# EAGLE design PololuStepperDriverCarrierBoard (EAGLE 6.3)
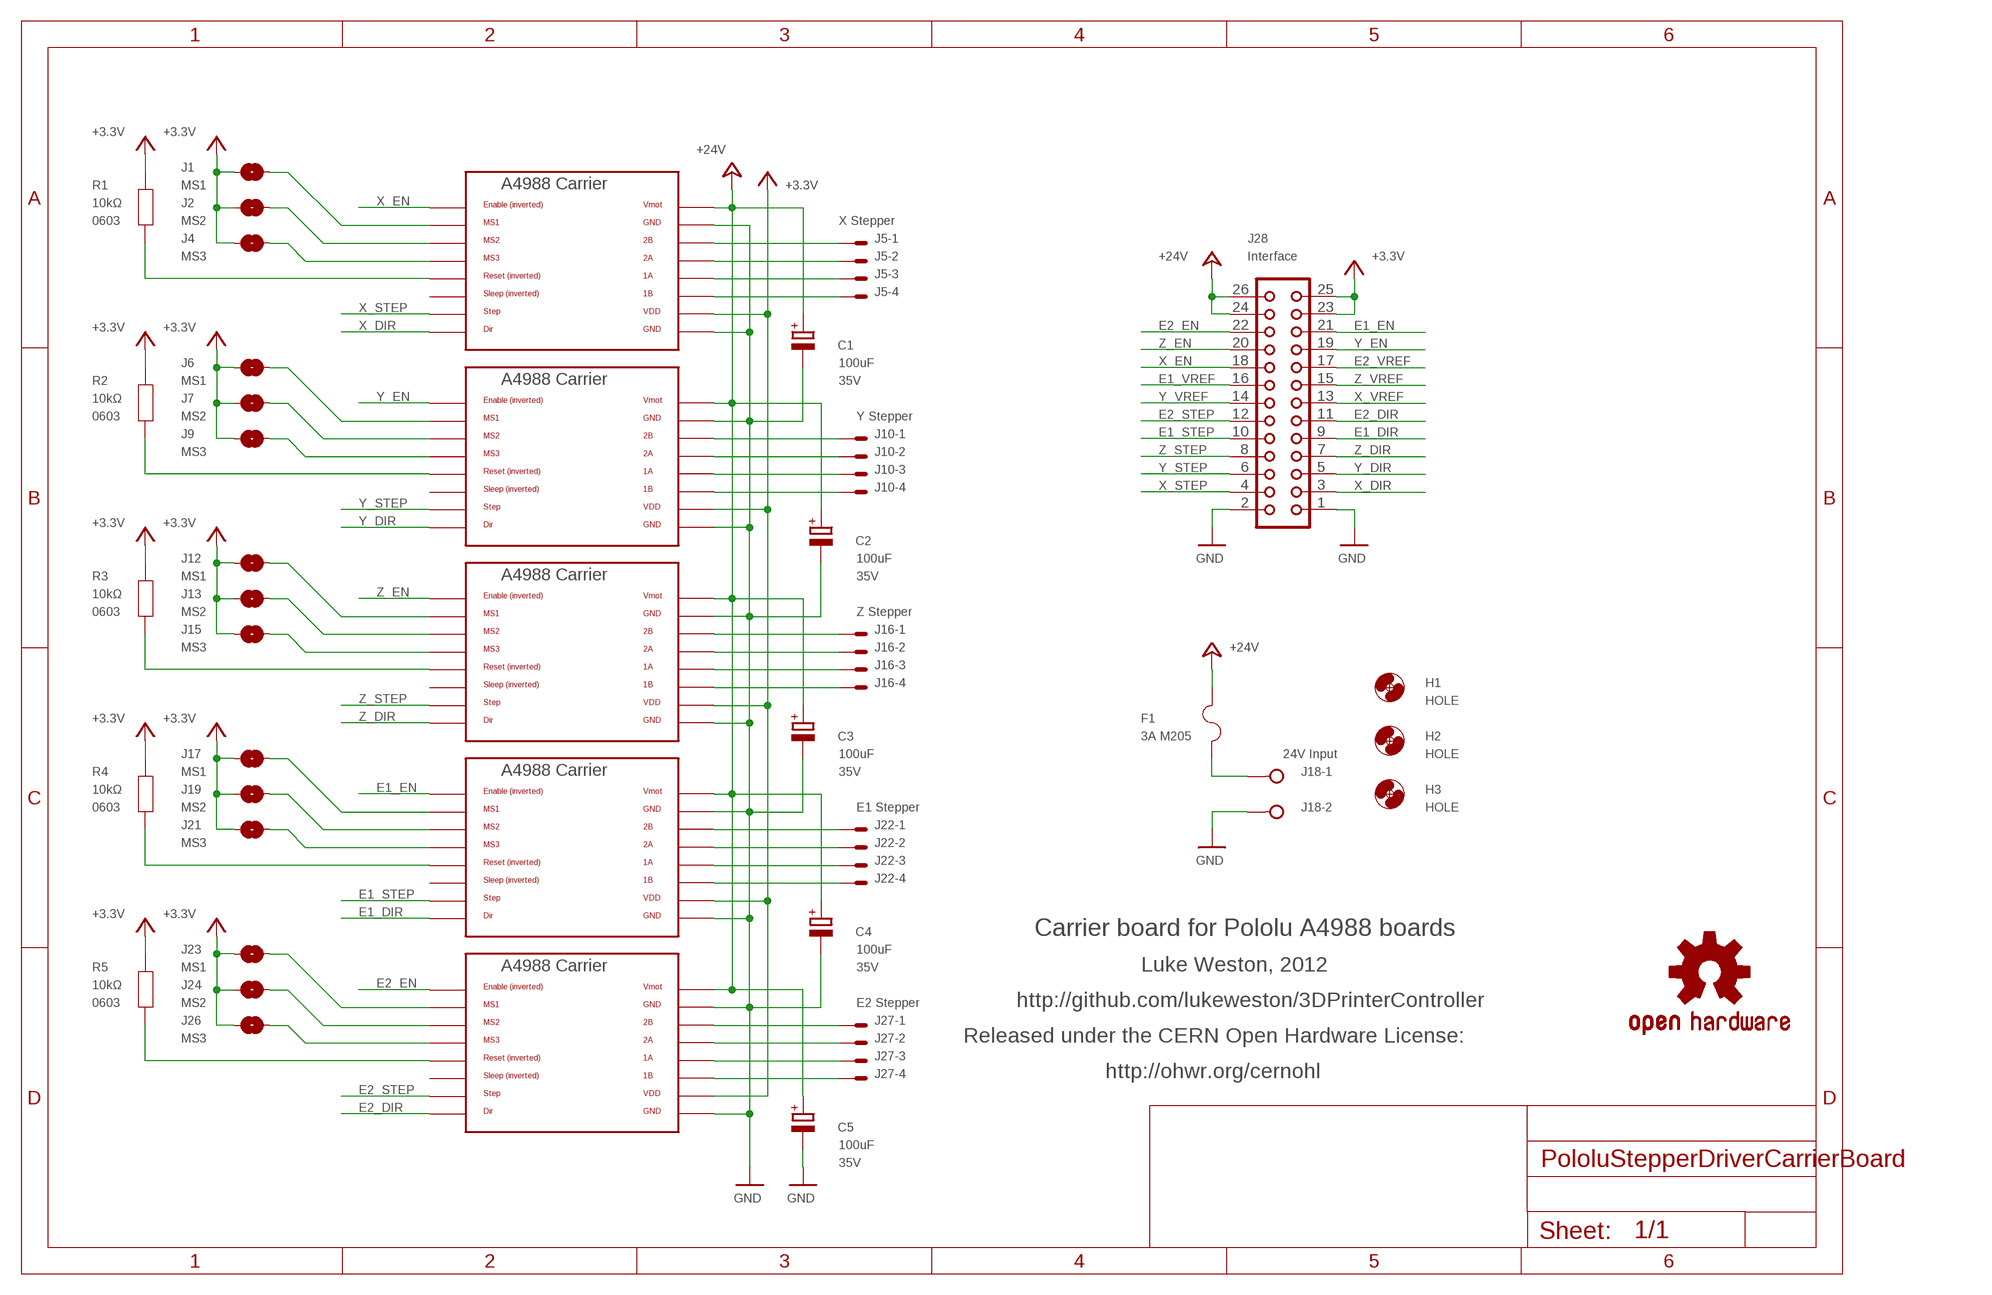
[diagram p0: schematic, sheet 1]

## Parts
C1  100uF  CPOL-EUE2.5-6  [E2,5-6]
C2  100uF  CPOL-EUE2.5-6  [E2,5-6]
C3  100uF  CPOL-EUE2.5-6  [E2,5-6]
C4  100uF  CPOL-EUE2.5-6  [E2,5-6]
C5  100uF  CPOL-EUE2.5-6  [E2,5-6]
F1  3A M205  FUSESHK20L  [SHK20L]
H1  HOLE  MOUNT-HOLE3.2  [3,2]
H2  HOLE  MOUNT-HOLE3.2  [3,2]
H3  HOLE  MOUNT-HOLE3.2  [3,2]
J1  MS1  SJ  [SJ]
J2  MS2  SJ  [SJ]
J3  A4988BREAKOUT  [A4988BREAKOUT]
J4  MS3  SJ  [SJ]
J5  X Stepper  22-05-7048-04  [7395-04]
J6  MS1  SJ  [SJ]
J7  MS2  SJ  [SJ]
J8  A4988BREAKOUT  [A4988BREAKOUT]
J9  MS3  SJ  [SJ]
J10  Y Stepper  22-05-7048-04  [7395-04]
J12  MS1  SJ  [SJ]
J13  MS2  SJ  [SJ]
J14  A4988BREAKOUT  [A4988BREAKOUT]
J15  MS3  SJ  [SJ]
J16  Z Stepper  22-05-7048-04  [7395-04]
J17  MS1  SJ  [SJ]
J18  24V Input  W237-02P  [W237-132]
J19  MS2  SJ  [SJ]
J20  A4988BREAKOUT  [A4988BREAKOUT]
J21  MS3  SJ  [SJ]
J22  E1 Stepper  22-05-7048-04  [7395-04]
J23  MS1  SJ  [SJ]
J24  MS2  SJ  [SJ]
J25  A4988BREAKOUT  [A4988BREAKOUT]
J26  MS3  SJ  [SJ]
J27  E2 Stepper  22-05-7048-04  [7395-04]
J28  Interface  CON26L  [CON26L]
R1  10kΩ  RESISTOR0603  [0603]
R2  10kΩ  RESISTOR0603  [0603]
R3  10kΩ  RESISTOR0603  [0603]
R4  10kΩ  RESISTOR0603  [0603]
R5  10kΩ  RESISTOR0603  [0603]
SY1  OSHW-LOGOS  [OSHW-LOGO-S]

## Nets
+3V3: J1.1 J2.1 J3.VDD J4.1 J6.1 J7.1 J8.VDD J9.1 J12.1 J13.1 J14.VDD J15.1 J17.1 J19.1 J20.VDD J21.1 J23.1 J24.1 J25.VDD J26.1 J28.23 J28.25 R1.1 R2.1 R3.1 R4.1 R5.1 ; supply symbol labelled +3.3V
+24V: C1.+ C2.+ C3.+ C4.+ C5.+ F1.2A J3.VMOT J8.VMOT J14.VMOT J20.VMOT J25.VMOT J28.24 J28.26
E1_DIR: J20.DIR J28.9
E1_EN: J20.EN J28.21
E1_STEP: J20.STEP J28.10
E1_VREF: J28.16
E2_DIR: J25.DIR J28.11
E2_EN: J25.EN J28.22
E2_STEP: J25.STEP J28.12
E2_VREF: J28.17
GND: C1.- C2.- C3.- C4.- C5.- J3.GND J3.GND@0(GND) J8.GND J8.GND@0(GND) J14.GND J14.GND@0(GND) J18.2 J20.GND J20.GND@0(GND) J25.GND J25.GND@0(GND) J28.1 J28.2
N$30: J8.RST R2.2
N$31: J3.2B J5.1
N$34: J3.1B J5.4
N$35: J3.1A J5.3
N$36: J3.2A J5.2
N$37: J8.2B J10.1
N$38: J8.1A J10.3
N$39: J8.2A J10.2
N$40: J8.1B J10.4
N$41: J14.2B J16.1
N$43: J14.1B J16.4
N$45: J14.1A J16.3
N$46: J14.2A J16.2
N$47: J20.2A J22.2
N$48: J20.2B J22.1
N$49: J20.1A J22.3
N$50: J20.1B J22.4
N$52: J25.2B J27.1
N$53: J25.2A J27.2
N$54: J25.1A J27.3
N$55: J25.1B J27.4
N$56: J3.RST R1.2
N$57: J8.MS3 J9.2
N$58: J7.2 J8.MS2
N$60: J3.MS3 J4.2
N$64: J2.2 J3.MS2
N$65: J1.2 J3.MS1
N$66: J6.2 J8.MS1
N$67: J14.RST R3.2
N$68: J14.MS3 J15.2
N$69: J13.2 J14.MS2
N$70: J12.2 J14.MS1
N$71: J25.RST R5.2
N$72: J25.MS3 J26.2
N$73: J24.2 J25.MS2
N$74: J23.2 J25.MS1
N$75: J20.RST R4.2
N$76: J20.MS3 J21.2
N$77: J19.2 J20.MS2
N$78: J17.2 J20.MS1
N$79: F1.1A J18.1
X_DIR: J3.DIR J28.3
X_EN: J3.EN J28.18
X_STEP: J3.STEP J28.4
X_VREF: J28.13
Y_DIR: J8.DIR J28.5
Y_EN: J8.EN J28.19
Y_STEP: J8.STEP J28.6
Y_VREF: J28.14
Z_DIR: J14.DIR J28.7
Z_EN: J14.EN J28.20
Z_STEP: J14.STEP J28.8
Z_VREF: J28.15
Unconnected: J3.SLP(SLEEP) J8.SLP(SLEEP) J14.SLP(SLEEP) J20.SLP(SLEEP) J25.SLP(SLEEP)

## Notes on the sheet
- Carrier board for Pololu A4988 boards
- Luke Weston, 2012
- http://github.com/lukeweston/3DPrinterController
- Released under the CERN Open Hardware License:
- http://ohwr.org/cernohl

## Library data of the parts
C1-C5 = rcl:CPOL-EU: POLARIZED CAPACITOR, European symbol; VOLTAGE: 35V
F1 = fuse:FUSE: Fuse; OC_FARNELL: unknown; OC_NEWARK: unknown
H1-H3 = holes:MOUNT-HOLE: MOUNTING HOLE with drill center marker
J1 J2 J4 J6 J7 J9 J12 J13 J15 J17 J19 J21 J23 J24 J26 = freetronics-luke:SJ: PCB "solder jumper". Note that there should nothing on the BOM corresponding to this "component".
J3 J8 J14 J20 J25 = RepRapjr:A4988BREAKOUT
J5 J10 J16 J22 J27 = con-molex:22-?-04: CONNECTOR wire to board 2.54 mm (.1 inch) pitch header; OC_FARNELL: unknown; OC_NEWARK: unknown
J18 = con-wago-508:W237-02P: WAGO SREW CLAMP; OC_FARNELL: unknown; OC_NEWARK: unknown
J28 = con-harting:CON26L: CONNECTOR; OC_FARNELL: unknown; OC_NEWARK: unknown
R1-R5 = freetronics-master-v1:RESISTOR: Resistor Basic schematic elements and footprints for 0603, 1206, and PTH 1/10th watt (small) resistors.; PACKAGE: 0603
SY1 = SparkFun:OSHW-LOGO: Open Source Hardware Logo This logo indicates the piece of hardware it is found on incorporates a OSHW license and/or adheres to the definition of open source hardware found here: http://freedomdefined.org/OSHW

## Board
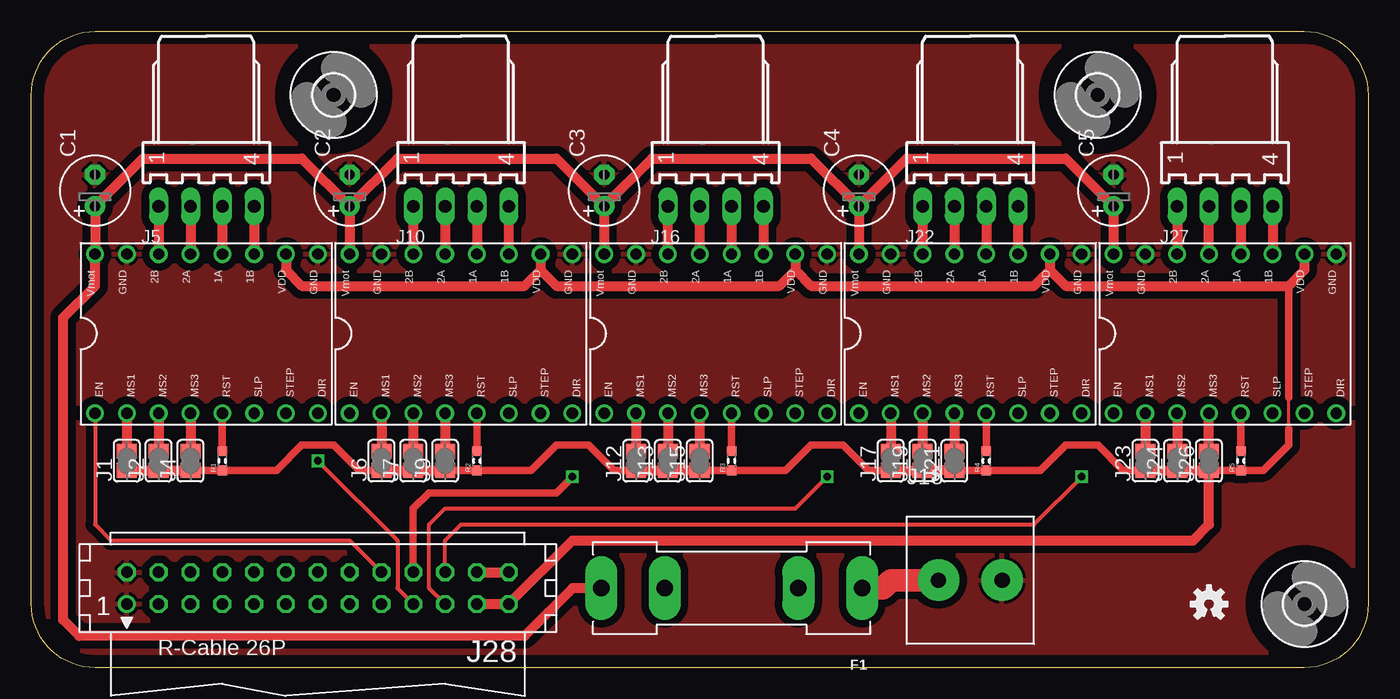
[diagram p1: board, top side]
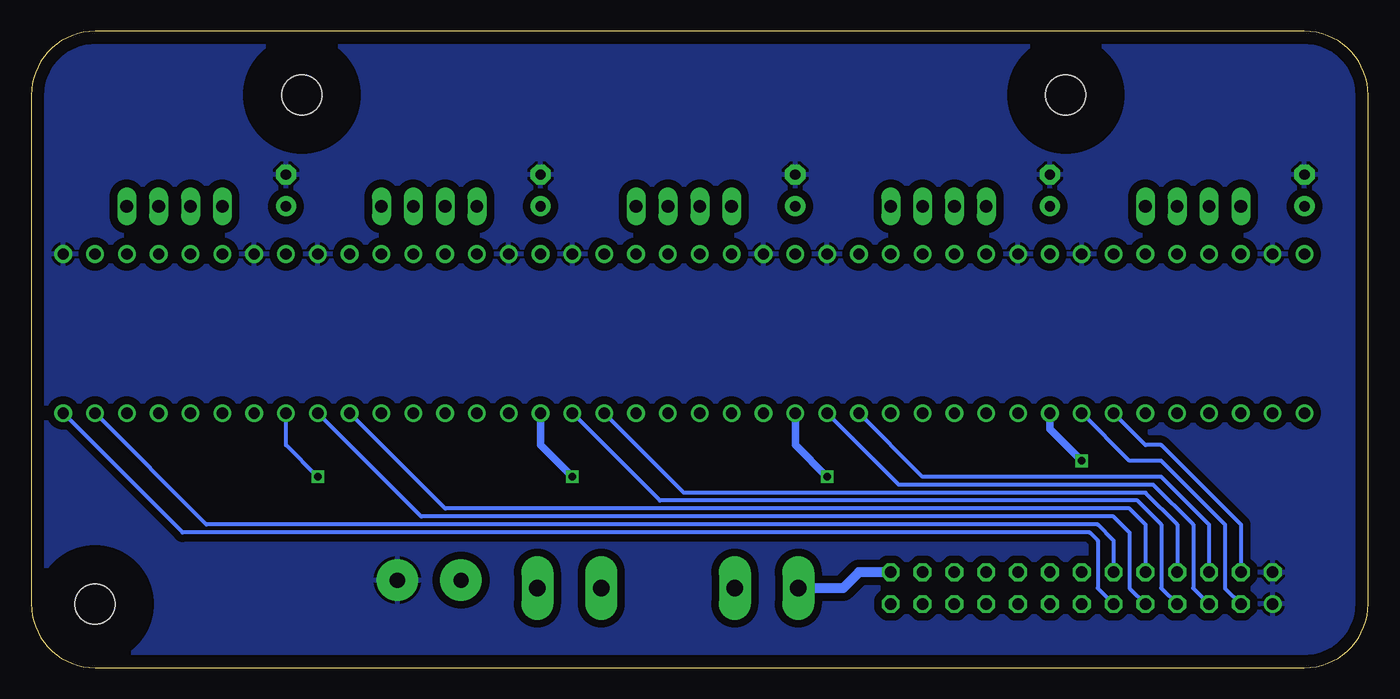
[diagram p2: board, bottom side, seen from below]

Size 106.68 x 50.8 mm. Coordinates in mm from the lower left corner, seen from the top.
Outline: 0,5.08 0,45.72 arc-90 5.08,50.8 101.6,50.8 arc-90 106.68,45.72 106.68,5.08 arc-90 101.6,0 5.08,0 arc-90 0,5.08
Copper layers (1*16): Top 0.035mm / dielectric 1.5mm / Bottom 0.035mm
Design rules "default": minimum track width 10mil, minimum drill 24mil, track to track 8mil, track to pad 8mil, pad to pad 8mil, via to via 8mil, smd to smd 8mil, copper to edge 40mil, drill to drill 8mil, minimum pad ring 10mil, minimum via ring 8mil, stop-mask expansion 4mil, vias tented up to drill 0mil, thermal gap 10mil

### Footprints (pad centres in the part's own frame; a part is rotated, then mirrored left to right if it is on the bottom)
E2,5-6 = drill 0.813 pad 1.6: + -1.27,0 | drill 0.813 pad 1.6 octagon: - 1.27,0
SHK20L = drill 1.321 pad 2.54 long: 1A -10.414,0; 1B -5.334,0; 2A 10.414,0; 2B 5.334,0
3,2 = hole 3.2: 0,0
SJ = smd 1.168 x 1.6: 1 -0.762,0; 2 0.762,0
A4988BREAKOUT = drill 0.9: 1A 8.89,1.27; 1B 11.43,1.27; 2A 6.35,1.27; 2B 3.81,1.27; DIR 16.51,-11.43; EN -1.27,-11.43; GND 16.51,1.27; GND@0 1.27,1.27; MS1 1.27,-11.43; MS2 3.81,-11.43; MS3 6.35,-11.43; RST 8.89,-11.43; SLP 11.43,-11.43; STEP 13.97,-11.43; VDD 13.97,1.27; VMOT -1.27,1.27
7395-04 = drill 1.016 long: 1 3.81,0; 2 1.27,0; 3 -1.27,0; 4 -3.81,0
W237-132 = drill 1.2 pad 3.302: 1 -2.54,-0.635; 2 2.54,-0.635
CON26L = drill 0.914: 1 15.24,1.27 | drill 0.914 octagon: 2 15.24,-1.27; 3 12.7,1.27; 4 12.7,-1.27; 5 10.16,1.27; 6 10.16,-1.27; 7 7.62,1.27; 8 7.62,-1.27; 9 5.08,1.27; 10 5.08,-1.27; 11 2.54,1.27; 12 2.54,-1.27; 13 0,1.27; 14 0,-1.27; 15 -2.54,1.27; 16 -2.54,-1.27; 17 -5.08,1.27; 18 -5.08,-1.27; 19 -7.62,1.27; 20 -7.62,-1.27; 21 -10.16,1.27; 22 -10.16,-1.27; 23 -12.7,1.27; 24 -12.7,-1.27; 25 -15.24,1.27; 26 -15.24,-1.27
0603 = smd 0.762 x 0.762: 1 -0.762,0; 2 0.762,0

### Placement (x,y rotation side)
C1  5.08,38.1 90 top
C2  25.4,38.1 90 top
C3  45.72,38.1 90 top
C4  66.04,38.1 90 top
C5  86.36,38.1 90 top
F1  55.88,6.35 180 top
H1  101.6,5.08 0 top
H2  85.09,45.72 0 top
H3  24.13,45.72 0 top
J1  7.62,16.51 90 top
J2  10.16,16.51 90 top
J3  6.35,31.75 0 top
J4  12.7,16.51 90 top
J5  13.97,36.83 180 top
J6  27.94,16.51 90 top
J7  30.48,16.51 90 top
J8  26.67,31.75 0 top
J9  33.02,16.51 90 top
J10  34.29,36.83 180 top
J12  48.26,16.51 90 top
J13  50.8,16.51 90 top
J14  46.99,31.75 0 top
J15  53.34,16.51 90 top
J16  54.61,36.83 180 top
J17  68.58,16.51 90 top
J18  74.93,7.62 0 top
J19  71.12,16.51 90 top
J20  67.31,31.75 0 top
J21  73.66,16.51 90 top
J22  74.93,36.83 180 top
J23  88.9,16.51 90 top
J24  91.44,16.51 90 top
J25  87.63,31.75 0 top
J26  93.98,16.51 90 top
J27  95.25,36.83 180 top
J28  22.86,6.35 180 top
R1  15.24,16.51 90 top
R2  35.56,16.51 90 top
R3  55.88,16.51 90 top
R4  76.2,16.51 90 top
R5  96.52,16.51 90 top
SY1  93.98,5.08 0 top

### Tracks (layer width: path | path; a pad name or v marks a point on that pad's centre or on a via)
+3V3
  Top 0.254: 100.33,19.05 100.33,21.59
  Top 0.61: J26.1 R5.1 98.3,15.75 100.33,17.78 100.33,19.05 | J4.1 R1.1 19.56,15.75 21.59,17.78 24.13,17.78 26.16,15.75 J6.1 | 100.33,30.48 100.33,21.59 | J9.1 R2.1 39.88,15.75 41.91,17.78 44.45,17.78 46.48,15.75 J12.1 | J15.1 R3.1 60.2,15.75 62.23,17.78 64.77,17.78 66.8,15.75 J17.1 | J21.1 R4.1 80.52,15.75 82.55,17.78 85.09,17.78 87.12,15.75 J23.1
  Top 0.813: J23.1 J24.1 J26.1 93.98,11.43 92.71,10.16 43.18,10.16 J28.25 J28.23 | J1.1 J2.1 J4.1 | J25.VDD 101.6,31.75 100.33,30.48 82.55,30.48 81.28,31.75 | J20.VDD 81.28,31.75 | J14.VDD 60.96,31.75 | 60.96,31.75 62.23,30.48 80.01,30.48 81.28,31.75 | J3.VDD 20.32,31.75 21.59,30.48 39.37,30.48 40.64,31.75 | J8.VDD 40.64,31.75 | 40.64,31.75 41.91,30.48 59.69,30.48 60.96,31.75 | J6.1 J7.1 | J7.1 J9.1 | J12.1 J13.1 J15.1 | J17.1 J19.1 J21.1 | J7.1 32.89,15.75 33.02,15.88
+24V
  Top 0.813: J25.VMOT C5.+ 82.55,40.64 69.85,40.64 C4.+ | C2.+ J8.VMOT | C3.+ J14.VMOT | C4.+ J20.VMOT | C2.+ 21.59,40.64 8.89,40.64 C1.+ J3.VMOT 5.08,30.48 2.54,27.94 2.54,3.81 3.81,2.54 39.37,2.54 43.18,6.35 F1.2A | C2.+ 29.21,40.64 41.91,40.64 C3.+ | C3.+ 49.53,40.64 62.23,40.64 C4.+ | J28.24 J28.26
  Bottom 0.813: J28.26 40.64,7.62 41.91,6.35 F1.2A
E1_DIR
  Bottom 0.305: J20.DIR 75.57,12.06 20.32,12.06 19.05,10.79 19.05,6.35 J28.9
E1_EN  (via drill 0.6)
  Top 0.305: J28.21 31.75,6.35 31.75,11.43 33.02,12.7 60.96,12.7 v63.5,15.24
  Bottom 0.61: J20.EN 66.04,17.78 v63.5,15.24
E1_STEP
  Bottom 0.305: J20.STEP 73.66,12.7 19.05,12.7 17.78,11.43 J28.10
E2_DIR
  Bottom 0.305: J25.DIR 94.62,10.79 22.22,10.79 21.59,10.16 21.59,6.35 J28.11
E2_EN  (via drill 0.6)
  Top 0.305: J28.22 33.02,10.16 34.29,11.43 80.01,11.43 v83.82,15.24
  Bottom 0.305: v83.82,15.24 86.36,17.78 J25.EN
E2_STEP
  Bottom 0.305: J25.STEP 92.71,11.43 21.59,11.43 20.32,10.16 J28.12
GND
  pour Top (isolate 0.61): 0,45.72 arc-90 5.08,50.8 101.6,50.8 arc-90 106.68,45.72 106.68,5.08 arc-90 101.6,0 5.08,0 arc-90 0,5.08
  pour Bottom (isolate 0.61): 0,45.72 arc-90 5.08,50.8 101.6,50.8 arc-90 106.68,45.72 106.68,5.08 arc-90 101.6,0 5.08,0 arc-90 0,5.08
N$30
  Top 0.61: J8.RST R2.2
N$31
  Top 0.813: J5.1 J3.2B
N$34
  Top 0.813: J5.4 J3.1B
N$35
  Top 0.813: J5.3 J3.1A
N$36
  Top 0.813: J5.2 J3.2A
N$37
  Top 0.813: J10.1 J8.2B
N$38
  Top 0.813: J10.3 J8.1A
N$39
  Top 0.813: J10.2 J8.2A
N$40
  Top 0.813: J10.4 J8.1B
N$41
  Top 0.813: J14.2B J16.1
N$43
  Top 0.813: J16.4 J14.1B
N$45
  Top 0.813: J16.3 J14.1A
N$46
  Top 0.813: J16.2 J14.2A
N$47
  Top 0.813: J22.2 J20.2A
N$48
  Top 0.813: J22.1 J20.2B
N$49
  Top 0.813: J22.3 J20.1A
N$50
  Top 0.813: J22.4 J20.1B
N$52
  Top 0.813: J27.1 J25.2B
N$53
  Top 0.813: J25.2A J27.2
N$54
  Top 0.813: J27.3 J25.1A
N$55
  Top 0.813: J27.4 J25.1B
N$56
  Top 0.61: J3.RST R1.2
N$57
  Top 0.813: J8.MS3 J9.2
N$58
  Top 0.813: J8.MS2 J7.2
N$60
  Top 0.813: J3.MS3 J4.2
N$64
  Top 0.813: J3.MS2 J2.2
N$65
  Top 0.813: J3.MS1 J1.2
N$66
  Top 0.813: J8.MS1 J6.2
N$67
  Top 0.61: R3.2 J14.RST
N$68
  Top 0.813: J14.MS3 J15.2
N$69
  Top 0.813: J14.MS2 J13.2
N$70
  Top 0.813: J14.MS1 J12.2
N$71
  Top 0.61: R5.2 J25.RST
N$72
  Top 0.813: J26.2 J25.MS3
N$73
  Top 0.813: J25.MS2 J24.2
N$74
  Top 0.813: J25.MS1 J23.2
N$75
  Top 0.61: J20.RST R4.2
N$76
  Top 0.813: J20.MS3 J21.2
N$77
  Top 0.813: J20.MS2 J19.2
N$78
  Top 0.813: J20.MS1 J17.2
N$79
  Top 1.778: F1.1A 67.95,6.35 68.58,6.99 J18.1
X_DIR
  Bottom 0.305: J3.DIR 19.05,16.51 16.51,16.51 11.43,11.43 11.43,6.35 J28.3
X_EN
  Top 0.305: J3.EN 5.08,11.43 6.35,10.16 25.4,10.16 J28.18
X_STEP
  Bottom 0.305: J3.STEP 17.78,17.78 16.51,17.78 10.16,11.43 J28.4
Y_DIR
  Bottom 0.305: J8.DIR 37.46,14.61 17.14,14.61 13.97,11.43 13.97,6.35 J28.5
Y_EN  (via drill 0.6)
  Top 0.305: v22.86,16.51 29.21,10.16 29.21,6.35 J28.19
  Bottom 0.61: J8.EN 25.4,19.05 v22.86,16.51
Y_STEP
  Bottom 0.305: J8.STEP 35.56,15.24 16.51,15.24 12.7,11.43 J28.6
Z_DIR
  Bottom 0.305: J14.DIR 56.52,13.34 18.41,13.34 16.51,11.43 16.51,6.35 J28.7
Z_EN  (via drill 0.6)
  Top 0.61: v43.18,15.24 41.91,13.97 31.75,13.97 30.48,12.7 J28.20
  Bottom 0.61: J14.EN 45.72,17.78 v43.18,15.24
Z_STEP
  Bottom 0.305: J14.STEP 54.61,13.97 17.78,13.97 15.24,11.43 J28.8